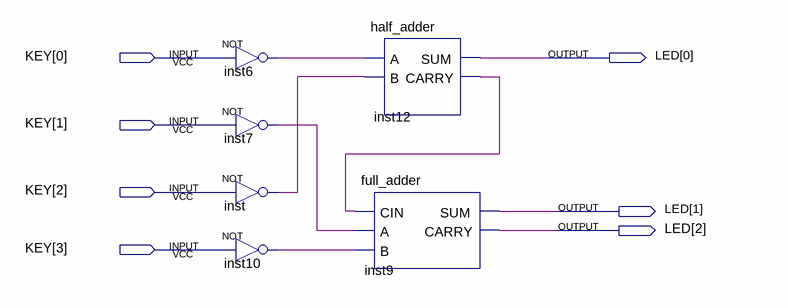
[diagram p0: schematic sheet]
// Quartus schematic week_02.bdf as structural Verilog: 6 symbols, 7 pins
module week_02 (
  input  [3:0] KEY,
  output [2:0] LED
);

  wire inst6_out, inst7_out, inst10_out, inst12_carry, inst_out;

  not inst6 (inst6_out, KEY[0]);
  not inst7 (inst7_out, KEY[1]);
  not inst (inst_out, KEY[2]);
  not inst10 (inst10_out, KEY[3]);
  half_adder inst12 (.A(inst6_out), .B(inst_out), .SUM(LED[0]), .CARRY(inst12_carry));
  full_adder inst9 (.CIN(inst12_carry), .A(inst7_out), .B(inst10_out), .SUM(LED[1]), .CARRY(LED[2]));
endmodule
